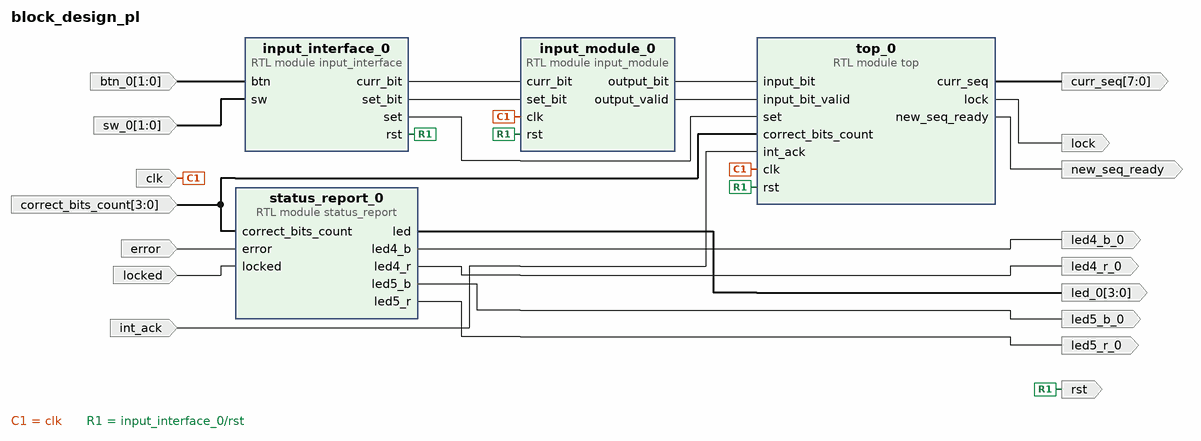
[diagram p0: block diagram of the top level]
# Vivado block design block_design_pl, xc7z020clg400-1, Vivado 2022.2
create_bd_design block_design_pl

create_bd_port -dir I locked
create_bd_port -dir I error
create_bd_port -dir I -from 3 -to 0 correct_bits_count
create_bd_port -dir O -from 7 -to 0 curr_seq
create_bd_port -dir O -type intr new_seq_ready
create_bd_port -dir O -type intr lock
create_bd_port -dir O -type rst rst
create_bd_port -dir I -type clk clk
set_property -dict {CONFIG.FREQ_HZ 10000000} [get_bd_ports clk]
create_bd_port -dir I -from 1 -to 0 sw_0
create_bd_port -dir I -from 1 -to 0 btn_0
create_bd_port -dir O -from 3 -to 0 led_0
create_bd_port -dir O led4_b_0
create_bd_port -dir O led5_b_0
create_bd_port -dir O led4_r_0
create_bd_port -dir I int_ack
create_bd_port -dir O led5_r_0

create_bd_cell -type module -reference status_report status_report_0
create_bd_cell -type module -reference input_interface input_interface_0
create_bd_cell -type module -reference input_module input_module_0
create_bd_cell -type module -reference top top_0

# ---- connections ----

connect_bd_net [get_bd_ports clk] [get_bd_pins input_module_0/clk] [get_bd_pins top_0/clk]
connect_bd_net [get_bd_ports correct_bits_count] [get_bd_pins status_report_0/correct_bits_count] [get_bd_pins top_0/correct_bits_count]
connect_bd_net -net btn_0_1 [get_bd_ports btn_0] [get_bd_pins input_interface_0/btn]
connect_bd_net [get_bd_ports error] [get_bd_pins status_report_0/error]
connect_bd_net [get_bd_pins input_interface_0/curr_bit] [get_bd_pins input_module_0/curr_bit]
connect_bd_net [get_bd_pins input_interface_0/rst] [get_bd_ports rst] [get_bd_pins input_module_0/rst] [get_bd_pins top_0/rst]
connect_bd_net [get_bd_pins input_interface_0/set] [get_bd_pins top_0/set]
connect_bd_net [get_bd_pins input_interface_0/set_bit] [get_bd_pins input_module_0/set_bit]
connect_bd_net [get_bd_pins input_module_0/output_bit] [get_bd_pins top_0/input_bit]
connect_bd_net [get_bd_pins input_module_0/output_valid] [get_bd_pins top_0/input_bit_valid]
connect_bd_net [get_bd_ports int_ack] [get_bd_pins top_0/int_ack]
connect_bd_net [get_bd_ports locked] [get_bd_pins status_report_0/locked]
connect_bd_net [get_bd_pins status_report_0/led] [get_bd_ports led_0]
connect_bd_net [get_bd_pins status_report_0/led4_b] [get_bd_ports led4_b_0]
connect_bd_net [get_bd_pins status_report_0/led4_r] [get_bd_ports led4_r_0]
connect_bd_net [get_bd_pins status_report_0/led5_b] [get_bd_ports led5_b_0]
connect_bd_net [get_bd_pins status_report_0/led5_r] [get_bd_ports led5_r_0]
connect_bd_net -net sw_0_1 [get_bd_ports sw_0] [get_bd_pins input_interface_0/sw]
connect_bd_net [get_bd_pins top_0/curr_seq] [get_bd_ports curr_seq]
connect_bd_net [get_bd_pins top_0/lock] [get_bd_ports lock]
connect_bd_net [get_bd_pins top_0/new_seq_ready] [get_bd_ports new_seq_ready]

validate_bd_design
save_bd_design
